# Altium schematic sheet Mini_Keyboard_Altium.schdoc
size 307 x 219 mm
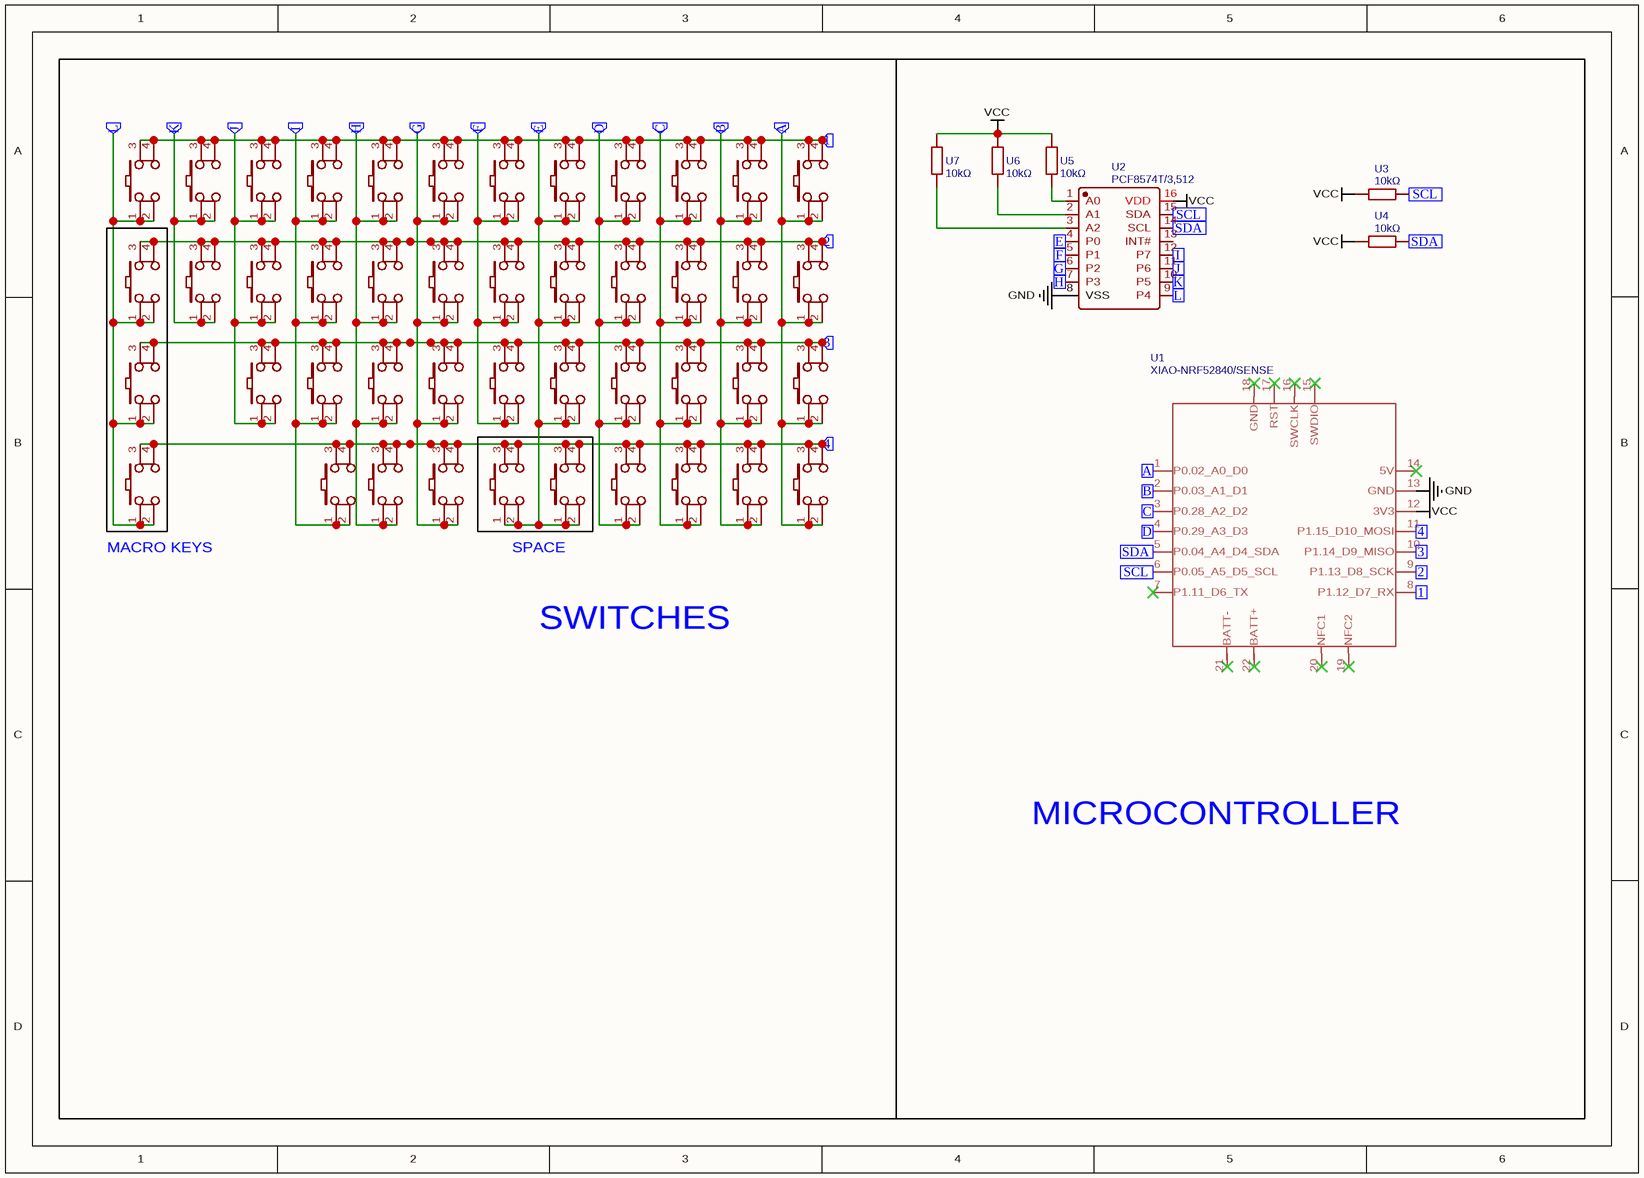
[diagram p0: Mini_Keyboard_Altium.schdoc]

## Parts
ESC  Switch-SMD-6x6x11  [SW-SMD_4P-L6.0-W6.0-P4.50-LS8.5]  (value not drawn)
MAC1  Switch-SMD-6x6x11  [SW-SMD_4P-L6.0-W6.0-P4.50-LS8.5]  (value not drawn)
MAC2  Switch-SMD-6x6x11  [SW-SMD_4P-L6.0-W6.0-P4.50-LS8.5]  (value not drawn)
MAC3  Switch-SMD-6x6x11  [SW-SMD_4P-L6.0-W6.0-P4.50-LS8.5]  (value not drawn)
SW1  Switch-SMD-6x6x11  [SW-SMD_4P-L6.0-W6.0-P4.50-LS8.5]  (value not drawn)
SW2  Switch-SMD-6x6x11  [SW-SMD_4P-L6.0-W6.0-P4.50-LS8.5]  (value not drawn)
SW3  Switch-SMD-6x6x11  [SW-SMD_4P-L6.0-W6.0-P4.50-LS8.5]  (value not drawn)
SW4  Switch-SMD-6x6x11  [SW-SMD_4P-L6.0-W6.0-P4.50-LS8.5]  (value not drawn)
SW5  Switch-SMD-6x6x11  [SW-SMD_4P-L6.0-W6.0-P4.50-LS8.5]  (value not drawn)
SW6  Switch-SMD-6x6x11  [SW-SMD_4P-L6.0-W6.0-P4.50-LS8.5]  (value not drawn)
SW7  Switch-SMD-6x6x11  [SW-SMD_4P-L6.0-W6.0-P4.50-LS8.5]  (value not drawn)
SW8  Switch-SMD-6x6x11  [SW-SMD_4P-L6.0-W6.0-P4.50-LS8.5]  (value not drawn)
SW9  Switch-SMD-6x6x11  [SW-SMD_4P-L6.0-W6.0-P4.50-LS8.5]  (value not drawn)
SW10  Switch-SMD-6x6x11  [SW-SMD_4P-L6.0-W6.0-P4.50-LS8.5]  (value not drawn)
SW11  Switch-SMD-6x6x11  [SW-SMD_4P-L6.0-W6.0-P4.50-LS8.5]  (value not drawn)
SW12  Switch-SMD-6x6x11  [SW-SMD_4P-L6.0-W6.0-P4.50-LS8.5]  (value not drawn)
SW13  Switch-SMD-6x6x11  [SW-SMD_4P-L6.0-W6.0-P4.50-LS8.5]  (value not drawn)
SW14  Switch-SMD-6x6x11  [SW-SMD_4P-L6.0-W6.0-P4.50-LS8.5]  (value not drawn)
SW15  Switch-SMD-6x6x11  [SW-SMD_4P-L6.0-W6.0-P4.50-LS8.5]  (value not drawn)
SW16  Switch-SMD-6x6x11  [SW-SMD_4P-L6.0-W6.0-P4.50-LS8.5]  (value not drawn)
SW17  Switch-SMD-6x6x11  [SW-SMD_4P-L6.0-W6.0-P4.50-LS8.5]  (value not drawn)
SW18  Switch-SMD-6x6x11  [SW-SMD_4P-L6.0-W6.0-P4.50-LS8.5]  (value not drawn)
SW19  Switch-SMD-6x6x11  [SW-SMD_4P-L6.0-W6.0-P4.50-LS8.5]  (value not drawn)
SW20  Switch-SMD-6x6x11  [SW-SMD_4P-L6.0-W6.0-P4.50-LS8.5]  (value not drawn)
SW21  Switch-SMD-6x6x11  [SW-SMD_4P-L6.0-W6.0-P4.50-LS8.5]  (value not drawn)
SW22  Switch-SMD-6x6x11  [SW-SMD_4P-L6.0-W6.0-P4.50-LS8.5]  (value not drawn)
SW23  Switch-SMD-6x6x11  [SW-SMD_4P-L6.0-W6.0-P4.50-LS8.5]  (value not drawn)
SW24  Switch-SMD-6x6x11  [SW-SMD_4P-L6.0-W6.0-P4.50-LS8.5]  (value not drawn)
SW25  Switch-SMD-6x6x11  [SW-SMD_4P-L6.0-W6.0-P4.50-LS8.5]  (value not drawn)
SW27  Switch-SMD-6x6x11  [SW-SMD_4P-L6.0-W6.0-P4.50-LS8.5]  (value not drawn)
SW28  Switch-SMD-6x6x11  [SW-SMD_4P-L6.0-W6.0-P4.50-LS8.5]  (value not drawn)
SW29  Switch-SMD-6x6x11  [SW-SMD_4P-L6.0-W6.0-P4.50-LS8.5]  (value not drawn)
SW30  Switch-SMD-6x6x11  [SW-SMD_4P-L6.0-W6.0-P4.50-LS8.5]  (value not drawn)
SW31  Switch-SMD-6x6x11  [SW-SMD_4P-L6.0-W6.0-P4.50-LS8.5]  (value not drawn)
SW32  Switch-SMD-6x6x11  [SW-SMD_4P-L6.0-W6.0-P4.50-LS8.5]  (value not drawn)
SW33  Switch-SMD-6x6x11  [SW-SMD_4P-L6.0-W6.0-P4.50-LS8.5]  (value not drawn)
SW34  Switch-SMD-6x6x11  [SW-SMD_4P-L6.0-W6.0-P4.50-LS8.5]  (value not drawn)
SW35  Switch-SMD-6x6x11  [SW-SMD_4P-L6.0-W6.0-P4.50-LS8.5]  (value not drawn)
SW43  Switch-SMD-6x6x11  [SW-SMD_4P-L6.0-W6.0-P4.50-LS8.5]  (value not drawn)
SW44  Switch-SMD-6x6x11  [SW-SMD_4P-L6.0-W6.0-P4.50-LS8.5]  (value not drawn)
SW45  Switch-SMD-6x6x11  [SW-SMD_4P-L6.0-W6.0-P4.50-LS8.5]  (value not drawn)
SW46  Switch-SMD-6x6x11  [SW-SMD_4P-L6.0-W6.0-P4.50-LS8.5]  (value not drawn)
SW47  Switch-SMD-6x6x11  [SW-SMD_4P-L6.0-W6.0-P4.50-LS8.5]  (value not drawn)
SW48  Switch-SMD-6x6x11  [SW-SMD_4P-L6.0-W6.0-P4.50-LS8.5]  (value not drawn)
SW49  Switch-SMD-6x6x11  [SW-SMD_4P-L6.0-W6.0-P4.50-LS8.5]  (value not drawn)
U1  XIAO-NRF52840/SENSE  [XIAO-NRF52840/SENSE-MODULE14P-2.54-21X17.8MM]
U2  PCF8574T/3,512  [SO-16_L10.3-W7.5-P1.27-LS10.6-BL]
U3  10kΩ  [R0805]
U4  10kΩ  [R0805]
U5  10kΩ  [R0805]
U6  10kΩ  [R0805]
U7  10kΩ  [R0805]

## Blocks framed on the sheet
SWITCHES: ESC MAC1-MAC3 SW1-SW25 SW27-SW35 SW43-SW49
MICROCONTROLLER: U1-U7

## Ports
1 (in), 2 (in), 3 (in), 4 (in), A (in), B (in), C (in), D (in), E (in), F (in), G (in), H (in), I (in), J (in), K (in), L (in), SCL (in), SDA (in)

## Nets
GND: U1.13(GND) U2.8(VSS)
VCC: U1.12(3V3) U2.16(VDD) U3.1 U4.1 U5.2 U6.2 U7.2
1: SW1.3 SW1.4 SW2.3 SW2.4 SW3.3 SW3.4 SW4.3 SW4.4 SW5.3 SW5.4 SW6.3 SW6.4 SW7.3 SW7.4 SW8.3 SW8.4 SW9.3 SW9.4 SW10.3 SW10.4 SW11.3 SW11.4 SW12.3 SW12.4 U1.8(P1.12_D7_RX) ; port 1
2: MAC1.3 MAC1.4 SW13.3 SW13.4 SW14.3 SW14.4 SW15.3 SW15.4 SW16.3 SW16.4 SW17.3 SW17.4 SW18.3 SW18.4 SW19.3 SW19.4 SW20.3 SW20.4 SW21.3 SW21.4 SW22.3 SW22.4 SW23.3 SW23.4 U1.9(P1.13_D8_SCK) ; port 2
3: ESC.3 ESC.4 MAC2.3 MAC2.4 SW24.3 SW24.4 SW25.3 SW25.4 SW43.3 SW43.4 SW44.3 SW44.4 SW45.3 SW45.4 SW46.3 SW46.4 SW47.3 SW47.4 SW48.3 SW48.4 SW49.3 SW49.4 U1.10(P1.14_D9_MISO) ; port 3
4: MAC3.3 MAC3.4 SW27.3 SW27.4 SW28.3 SW28.4 SW29.3 SW29.4 SW30.3 SW30.4 SW31.3 SW31.4 SW32.3 SW32.4 SW33.3 SW33.4 SW34.3 SW34.4 SW35.3 SW35.4 U1.11(P1.15_D10_MOSI) ; port 4
A: ESC.1 ESC.2 SW10.1 SW10.2 SW13.1 SW13.2 SW27.1 SW27.2 U1.1(P0.02_A0_D0) ; port A
B: SW11.1 SW11.2 SW15.1 SW15.2 SW24.1 SW24.2 SW29.1 SW29.2 U1.2(P0.03_A1_D1) ; port B
C: SW12.1 SW12.2 SW14.1 SW14.2 SW25.1 SW25.2 SW28.1 SW28.2 U1.3(P0.28_A2_D2) ; port C
D: SW7.1 SW7.2 SW18.1 SW18.2 SW32.1 SW32.2 SW45.1 SW45.2 U1.4(P0.29_A3_D3) ; port D
E: SW8.1 SW8.2 SW17.1 SW17.2 SW30.1 SW30.2 SW31.1 SW31.2 SW44.1 SW44.2 U2.4(P0) ; port E
F: SW9.1 SW9.2 SW16.1 SW16.2 SW43.1 SW43.2 U2.5(P1) ; port F
G: SW4.1 SW4.2 SW21.1 SW21.2 SW35.1 SW35.2 SW48.1 SW48.2 U2.6(P2) ; port G
H: SW5.1 SW5.2 SW20.1 SW20.2 SW34.1 SW34.2 SW47.1 SW47.2 U2.7(P3) ; port H
I: SW6.1 SW6.2 SW19.1 SW19.2 SW33.1 SW33.2 SW46.1 SW46.2 U2.12(P7) ; port I
J: SW3.1 SW3.2 SW22.1 SW22.2 SW49.1 SW49.2 U2.11(P6) ; port J
K: SW2.1 SW2.2 SW23.1 SW23.2 U2.10(P5) ; port K
L: MAC1.1 MAC1.2 MAC2.1 MAC2.2 MAC3.1 MAC3.2 SW1.1 SW1.2 U2.9(P4) ; port L
SCL: U1.6(P0.05_A5_D5_SCL) U2.15(SDA) U3.2 ; port SCL
SDA: U1.5(P0.04_A4_D4_SDA) U2.14(SCL) U4.2 ; port SDA
NetU2_1: U2.1(A0) U5.1
NetU2_2: U2.2(A1) U6.1
NetU2_3: U2.3(A2) U7.1

Not connected (* = marked no-connect by the designer): U1 7(P1.11_D6_TX)* 14(5V)* 15(SWDIO)* 16(SWCLK)* 17(RST)* 18(GND)* 19(NFC2)* 20(NFC1)* 21(BATT-)* 22(BATT+)*; U2 13(INT#)

## Notes on the sheet
- (near MAC3) MACRO KEYS
- SPACE

## Library data of the parts
ESC MAC1-MAC3 SW1-SW25 SW27-SW35 SW43-SW49 = Switch-SMD-6x6x11: Manufacturer: BBJ; Manufacturer Part: Switch6*6*11; Supplier Part: C91998; Supplier: LCSC; JLCPCB Part Class: Extended Part; link: https://lcsc.com/eda_search?q=C91998&%26type=1&ref=editor; spicePre: S; spiceSymbolName: Switch-SMD-6x6x11
U1 = XIAO-NRF52840/SENSE: Contributor: jacobstamand; spicePre: U; spiceSymbolName: XIAO-NRF52840/SENSE
U2 = PCF8574T/3,512: Manufacturer: NXP(恩智浦); Contributor: LCSC; Supplier: LCSC; Supplier Part: C1522621; Manufacturer Part: PCF8574T/3,512; JLCPCB Part Class: Extended Part; link: https://lcsc.com/eda_search?q=C1522621&%26type=1&ref=editor; spicePre: U; spiceSymbolName: PCF8574T/3,512
U3-U7 = 10kΩ: Manufacturer: SEI(Stackpole Electronics Inc.); Manufacturer Part: RNCF0805TKW10K0; Contributor: lcsc; nameAlias: Value; Supplier: LCSC; Supplier Part: C4161841; link: https://lcsc.com/eda_search?q=C4161841&%26type=1&ref=editor; spicePre: U; spiceSymbolName: RNCF0805TKW10K0